# Altium project HV_DAC_1PPM.PrjPcb (part 3 of 3)

## Sheet HV_Stage.SchDoc: HV stage
size A3; Author: M.Beldyga; CompanyName: WUT ISE; DrawnBy: M.Beldyga; Organization: WUT ISE; Address1: PW ISE; Address2: Nowowiejska 15/19 00-665 Warsaw; Address3: micbeldyga@gmail.com; SheetNumber: 7; SheetTotal: 7; ModifiedBy: -; CheckedDate: -; DivGrp: WUT ISE; Designer: M.Beldyga; ModifiedDate: -; ProjectName: Sensor Box
Used 2 times, as channels U_HV_Stage, U_HV_Stage. Parts and nets are listed once, with the designators drawn on the sheet.
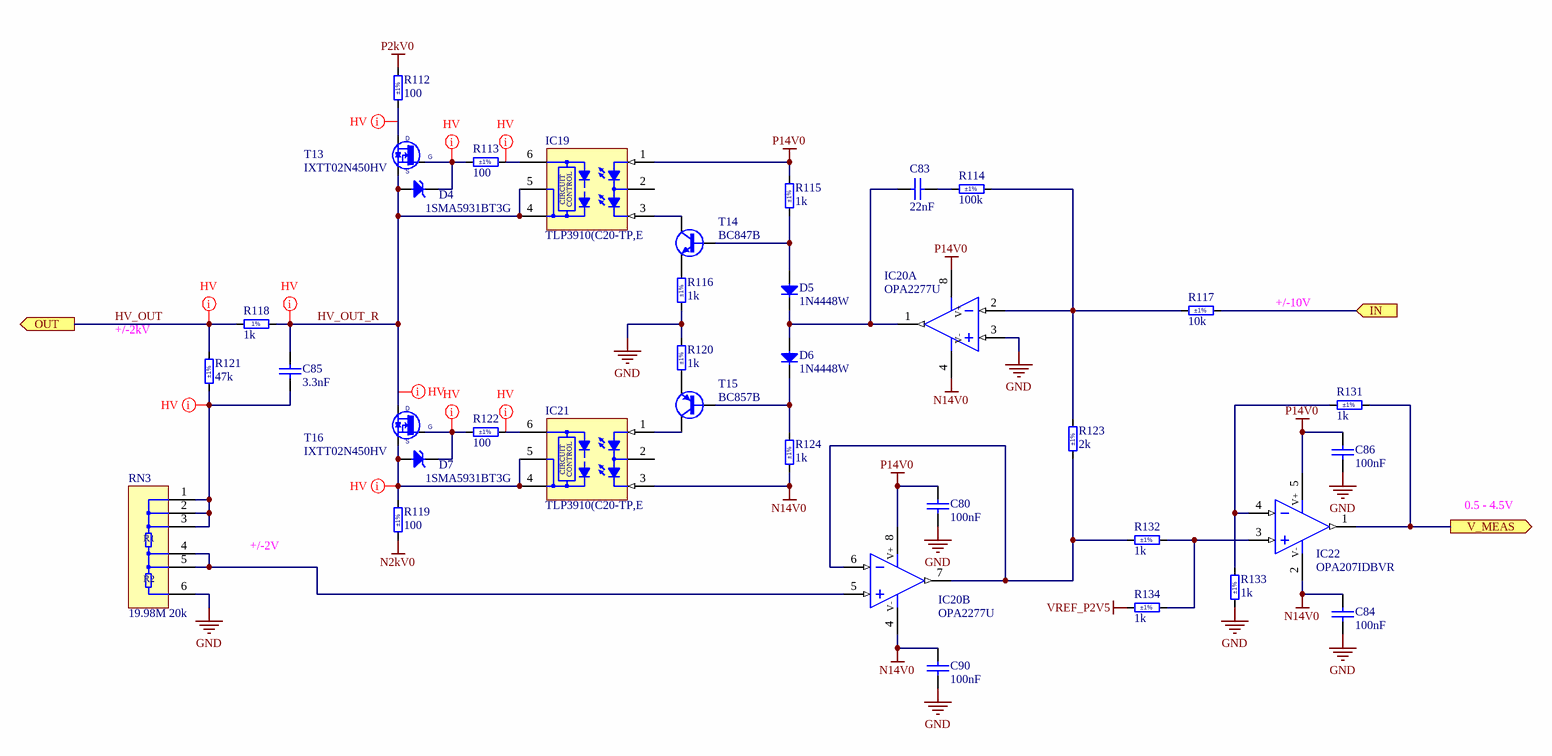
[diagram p6: HV_Stage.SchDoc]

### Parts
C80  100nF  [CAPC1005X55N]
C83  22nF  [CAPC1005X55N]
C84  100nF  [CAPC1005X55N]
C85  3.3nF  [CAPC1608X87N]
C86  100nF  [CAPC1005X55N]
C90  100nF  [CAPC1005X55N]
D4  1SMA5931BT3G  [DIOM5226X220N]
D5  1N4448W  [SOD3715X135N]
D6  1N4448W  [SOD3715X135N]
D7  1SMA5931BT3G  [DIOM5226X220N]
IC19  TLP3910(C20-TP,E  [TOSHIBA_SOIC127P1000X220-6N]
IC20  OPA2277U  [SOIC127P600X175-8N]  (parts A,B of 2)
IC21  TLP3910(C20-TP,E  [TOSHIBA_SOIC127P1000X220-6N]
IC22  OPA207IDBVR  [SOT95P280X145-5N]
R112  100  Tolerance: ±1%  [RESC2012X60N]
R113  100  Tolerance: ±1%  [RESC2012X60N]
R114  100k  Tolerance: ±1%  [RESC1005X40N]
R115  1k  Tolerance: ±1%  [RESC1005X40N]
R116  1k  Tolerance: ±1%  [RESC1005X40N]
R117  10k  Tolerance: ±1%  [RESC1005X40N]
R118  1k  [RESC6331X70N]
R119  100  Tolerance: ±1%  [RESC2012X60N]
R120  1k  Tolerance: ±1%  [RESC1005X40N]
R121  47k  Tolerance: ±1%  [RESC2012X60N]
R122  100  Tolerance: ±1%  [RESC2012X60N]
R123  2k  Tolerance: ±1%  [RESC1005X40N]
R124  1k  Tolerance: ±1%  [RESC1005X40N]
R131  1k  Tolerance: ±1%  [RESC1005X40N]
R132  1k  Tolerance: ±1%  [RESC1005X40N]
R133  1k  Tolerance: ±1%  [RESC1005X40N]
R134  1k  Tolerance: ±1%  [RESC1005X40N]
RN3  19.98M 20k  [RN_CADDOCK_HVD5_vertical]
T13  IXTT02N450HV  [IXYS_TO-268AA (D3Pak-HV)]
T14  BC847B  [SOT95P230X110-3N]
T15  BC857B  [SOT95P230X110-3N]
T16  IXTT02N450HV  [IXYS_TO-268AA (D3Pak-HV)]

### Ports
IN (in), OUT (out), V_MEAS (out)

### Nets
GND: C80.1 C84.1 C86.1 C90.1 IC20.3(IN+) R116.1 R120.2 R133.2 RN3.6
N2kV0: R119.2
N14V0: C84.2 C90.2 IC20.4(V-) IC21.3(K) IC22.2(V-) R124.1
P2kV0: R112.2
P14V0: C80.2 C86.2 IC19.1(A) IC20.8(V+) IC22.5(V+) R115.2
VREF_P2V5: R134.2
HV_OUT: R118.1 R121.2 ; port OUT
HV_OUT_R: C85.2 D4.2(A) IC19.4(K) IC19.5(K) R118.2 T13.2(S) T16.3(D)
IN: R117.2 ; port IN
V_MEAS: IC22.1(OUT) R131.1 ; port V_MEAS
NetC83_1: C83.1 D5.1(C) D6.2(A) IC20.1(OUT)
NetC83_2: C83.2 R114.1
NetC85_1: C85.1 R121.1 RN3.1 RN3.2 RN3.3
NetD4_1: D4.1(C) R113.2 T13.1(G)
NetD5_2: D5.2(A) R115.1 T14.1(B)
NetD6_1: D6.1(C) R124.2 T15.1(B)
NetD7_1: D7.1(C) R122.1 T16.1(G)
NetD7_2: D7.2(A) IC21.4(K) IC21.5(K) R119.1 T16.2(S)
NetIC19_3: IC19.3(K) T14.3(C)
NetIC19_6: IC19.6(A) R113.1
NetIC20_2: IC20.2(IN-) R114.2 R117.1 R123.2
NetIC20_5: IC20.5(IN+) RN3.4 RN3.5
NetIC20_6: IC20.6(IN-) IC20.7(OUT) R123.1 R132.2
NetIC21_1: IC21.1(A) T15.3(C)
NetIC21_6: IC21.6(A) R122.2
NetIC22_3: IC22.3(IN+) R132.1 R134.1
NetIC22_4: IC22.4(IN-) R131.2 R133.1
NetR112_1: R112.1 T13.3(D)
NetR116_2: R116.2 T14.2(E)
NetR120_1: R120.1 T15.2(E)

Not connected (* = marked no-connect by the designer): IC19 2(NC); IC21 2(NC)

### Channels
U_HV_Stage: designators end in B; ports IN=DAC_RFB OUT=HV_OUT V_MEAS=ADC_AIN4
U_HV_Stage: designators end in A; ports IN=DAC_RFB OUT=HV_OUT V_MEAS=ADC_AIN1

### Layout directives
net class HV: HV_OUT, HV_OUT_R_U_HV_Stage, NetC85B_1, NetD4B_1, NetD7B_1, NetD7B_2, NetIC19B_6, NetIC21B_6, NetR112B_1

### Notes on the sheet
- +/-2kV
- +/-10V
- 0.5 - 4.5V
- +/-2V
- Project/Equipment
- Document
- Designer
- Drawn by
- Check.by
- Contact
- File
- Last Mod.
- Print Date
- Sheet
- Size
- A3
- of
- Rev
- (in symbol CRMV2512AF1K00FKEF) 1%
- (in symbol RN_19.98M_20K_CADDOCK_HVD5-A20M-050-05) R1; R2
- (in symbol TLP3910(C20-TP,E) CIRCUIT; CONTROL

### Library data of the parts
C80 C84 C86 C90 = CC0402_100NF_50V_10%_X7R: Non-polarised capacitor; Part Description: SMD Multilayer Chip Ceramic Capacitor; Manufacturer: GENERIC; Manufacturer1 Part Number: GRM155R71H104KE14D; Voltage: 50V; TC: X7R; Tolerance: ±10%; Part Number: CC0402_100NF_50V_10%_X7R; Component Kind: Standard; Component Type: Standard; Pin Count: 2; Value: 100nF; Status: None; Manufacturer Part Number: CC0402_100NF_50V_10%_X7R; Case: 0402; Mounted: Yes; Socket: No; SMD: Yes; Sense: No; Manufacturer1 Example: MURATA; Manufacturer1 ComponentHeight: 0.55mm; HelpURL: \\cern.ch\dfs\Applications\Altium\Datasheets\CC0402_MURATA_GRM155R71H104KE14D.pdf; Author: CERN DEM MR; CreateDate: 6/30/2017; LatestRevisionDate: 6/30/2017
C83 = CC0402_22NF_50V_5%_X7R: Non-polarised capacitor; Part Description: SMD Multilayer Chip Ceramic Capacitor; Manufacturer: GENERIC; Manufacturer1 Part Number: C0402C223J5RAC; Voltage: 50V; TC: X7R; Tolerance: ±5%; Part Number: CC0402_22NF_50V_5%_X7R; Component Kind: Standard; Component Type: Standard; Pin Count: 2; Value: 22nF; Status: Preferred; Manufacturer Part Number: CC0402_22NF_50V_5%_X7R; Case: 0402; Mounted: Yes; Socket: No; SMD: Yes; Sense: No; Manufacturer1 Example: KEMET; Manufacturer1 ComponentHeight: 0.55mm; HelpURL: \\cern.ch\dfs\Applications\Altium\Datasheets\CC0402_X7R_KEMET.pdf; Author: CERN DEM BC; CreateDate: 7/15/2020; LatestRevisionDate: 7/15/2020
C85 = CC0603_3.3NF_100V_1%_C0G: Non-polarised capacitor; Part Description: SMD Multilayer Chip Ceramic Capacitor; Manufacturer: GENERIC; Manufacturer1 Part Number: C0603C332F1GEC; Voltage: 100V; TC: C0G/NP0; Tolerance: ±1%; Part Number: CC0603_3.3NF_100V_1%_C0G; Component Kind: Standard; Component Type: Standard; Pin Count: 2; Value: 3.3nF; Status: None; Manufacturer Part Number: CC0603_3.3NF_100V_1%_C0G; Case: 0603; Mounted: Yes; Socket: No; SMD: Yes; Sense: No; Manufacturer1 Example: KEMET; Manufacturer1 ComponentHeight: 0.87mm; HelpURL: \\cern.ch\dfs\Applications\Altium\Datasheets\CC0603_ESD_C0G_KEMET.pdf; Author: CERN DEM HF; CreateDate: 2/7/2024; LatestRevisionDate: 2/7/2024
D4 D7 = 1SMA5931BT3G: Zener Diode; Part Description: Zener Voltage Regulators; Manufacturer: ON SEMICONDUCTOR; Voltage: 18V; Power: 1.5W; PressFit: No; Bonding: No; Part Number: 1SMA5931BT3G; Component Kind: Standard; Component Type: Standard; Device: 1SMA5931BT3G; PackageDescription: DO-214-AC/SMA Diode, Molded Body; 5.21mm L X 2.60mm W X 2.20mm H, IPC Medium Density; Manufacturer Part Number: 1SMA5931B; Pin Count: 2; Case: DO-214AC; Mounted: Yes; Socket: No; SMD: Yes; Sense: No; ComponentHeight: 2.20mm; HelpURL: \\cern.ch\dfs\Applications\Altium\Datasheets\1SMA5931BT3G.pdf; Author: CERN DEM BC; CreateDate: 4/23/2020; LatestRevisionDate: 5/24/2022
D5 D6 = 1N4448W: Diode; Part Description: Surface Mount Small Signal Fast Switching Diode; Manufacturer: VISHAY SEMICONDUCTORS; Voltage: 75V; Power: 150mA; PressFit: No; Bonding: No; Part Number: 1N4448W; Component Kind: Standard; Component Type: Standard; Device: 1N4448W; PackageDescription: SOD Diode (SOD-123); 2.70mm W X 1.55mm L X 1.35mm H body, IPC Medium Density; Manufacturer Part Number: 1N4448W; Pin Count: 2; Case: SOD-123; Mounted: Yes; Socket: No; SMD: Yes; Sense: No; ComponentHeight: 1.35mm; HelpURL: \\cern.ch\dfs\Applications\Altium\Datasheets\1N4448W.pdf; Author: CERN DEM JLC; CreateDate: 5/15/2017; LatestRevisionDate: 5/15/2017
IC19 IC21 = TLP3910(C20-TP,E: Optoisolator Photovoltaic Output 5000Vrms 2 Channel; Manufacturer: TOSHIBA; PressFit: No; Bonding: No; Part Number: TLP3910(C20-TP,E; Component Kind: Standard; Component Type: Standard; Device: TLP3910(C20-TP,E; PackageDescription: TOSHIBA Case, SOIC, 1.27mm Pitch; 6  Pin, 7.5mm W X 3.84mm; Part Description: Optoisolator Photovoltaic Output 5000Vrms 2 Channel; Manufacturer Part Number: TLP3910(C20-TP,E; Pin Count: 6; Case: SOIC6; Mounted: Yes; Socket: No; SMD: Yes; Sense: No; ComponentHeight: 2.2mm; HelpURL: \\cern.ch\dfs\Applications\Altium\Datasheets\TLP3910.pdf; Author: CERN DEM HF; CreateDate: 6/7/2022; LatestRevisionDate: 6/7/2022
IC20 = OPA2277U: Dual Operational Amplifier; Part Description: Dual High Precision, Operational Amplifier; Manufacturer: TEXAS INSTRUMENTS; PressFit: No; Bonding: No; Part Number: OPA2277U; Component Kind: Standard; Component Type: Standard; Device: OPA2277U; PackageDescription: SOIC 8, Pitch 1.27mm - Body 4x5mm, IPC Medium Density; Manufacturer Part Number: OPA2277U; Pin Count: 8; Case: SOIC8; Mounted: Yes; Socket: No; SMD: Yes; Sense: No; ComponentHeight: 1.75mm; Author: CERN DEM BC; HelpURL: \\cern.ch\dfs\Applications\Altium\Datasheets\OPA2277U.pdf; CreateDate: 8/24/2016; LatestRevisionDate: 8/24/2016
IC22 = OPA207IDBVR: 2.2nV/sqrt Hz, Low-Power, 36-V Operational Amplifier; Manufacturer: TEXAS INSTRUMENTS; Part Number: OPA207IDBVR; Device: OPA207IDBVR; Component Kind: Standard; Component Type: Standard; PackageDescription: SOT, 0.95mm pitch; 5 pin, 1.60mm W X 2.90mm L X 1.45mm H body, IPC Medium Density; Part Description: 2.2nV/sqrt Hz, Low-Power, 36-V Operational Amplifier; Case: SOT 23-5; Manufacturer Part Number: OPA207IDBVR
R112 R113 R119 R122 = R0805_100R_1%_0.125W_100PPM: Resistor - 1%; Part Description: General Purpose Thick Film Chip Resistor; Manufacturer: GENERIC; Manufacturer1 Part Number: NRC10F4700TRF; Power: 0.125W; TC: ±100ppm/°C; PressFit: No; Part Number: R0805_100R_1%_0.125W_100PPM; Component Kind: Standard; Component Type: Standard; Pin Count: 2; Value: 100; Status: Preferred; Manufacturer Part Number: R0805_100R_1%_0.125W_100PPM; Case: 0805; Mounted: Yes; Sense: No; Socket: No; SMD: Yes; Manufacturer1 Example: NIC COMPONENT; Manufacturer1 ComponentHeight: 0.6mm; HelpURL: \\cern.ch\dfs\Applications\Altium\Datasheets\R0805_NIC_NRC.pdf; Author: CERN DEM JLC; CreateDate: 12/3/2007; LatestRevisionDate: 3/13/2008
R114 = R0402_100K_1%_0.0625W_100PPM: Resistor - 1%; Part Description: General Purpose Thick Film Chip Resistor; Manufacturer: GENERIC; Manufacturer1 Part Number: 232270671004L; TC: ±100ppm/°C; PressFit: No; Part Number: R0402_100K_1%_0.0625W_100PPM; Component Kind: Standard; Component Type: Standard; Pin Count: 2; Value: 100k; Status: Not Recommended; Power: 0.0625W; Manufacturer Part Number: R0402_100K_1%_0.0625W_100PPM; Case: 0402; Mounted: Yes; Sense: No; Socket: No; SMD: Yes; Manufacturer1 Example: YAGEO PHYCOMP; Manufacturer1 ComponentHeight: 0.4mm; HelpURL: \\cern.ch\dfs\Applications\Altium\Datasheets\R0402_Phycomp_RC0402.pdf; Author: CERN DEM JLC; CreateDate: 12/3/2007; LatestRevisionDate: 10/17/2012
R115 R116 R120 R124 R131-R134 = R0402_1K_1%_0.0625W_100PPM: Resistor - 1%; Part Description: General Purpose Thick Film Chip Resistor; Manufacturer: GENERIC; Manufacturer1 Part Number: 232270671002L; TC: ±100ppm/°C; PressFit: No; Part Number: R0402_1K_1%_0.0625W_100PPM; Component Kind: Standard; Component Type: Standard; Pin Count: 2; Value: 1k; Status: Not Recommended; Power: 0.0625W; Manufacturer Part Number: R0402_1K_1%_0.0625W_100PPM; Case: 0402; Mounted: Yes; Sense: No; Socket: No; SMD: Yes; Manufacturer1 Example: YAGEO PHYCOMP; Manufacturer1 ComponentHeight: 0.4mm; HelpURL: \\cern.ch\dfs\Applications\Altium\Datasheets\R0402_Phycomp_RC0402.pdf; Author: CERN DEM JLC; CreateDate: 12/3/2007; LatestRevisionDate: 10/17/2012
R117 = R0402_10K_1%_0.0625W_100PPM: Resistor - 1%; Part Description: General Purpose Thick Film Chip Resistor; Manufacturer: GENERIC; Manufacturer1 Part Number: 232270671003L; TC: ±100ppm/°C; PressFit: No; Part Number: R0402_10K_1%_0.0625W_100PPM; Component Kind: Standard; Component Type: Standard; Pin Count: 2; Value: 10k; Status: Not Recommended; Power: 0.0625W; Manufacturer Part Number: R0402_10K_1%_0.0625W_100PPM; Case: 0402; Mounted: Yes; Sense: No; Socket: No; SMD: Yes; Manufacturer1 Example: YAGEO PHYCOMP; Manufacturer1 ComponentHeight: 0.4mm; HelpURL: \\cern.ch\dfs\Applications\Altium\Datasheets\R0402_Phycomp_RC0402.pdf; Author: CERN DEM JLC; CreateDate: 12/3/2007; LatestRevisionDate: 10/17/2012
R118 = CRMV2512AF1K00FKEF: CRMV2512AF 1K 1% 100 Ef E3; Manufacturer: Vishay; Supplier: Mouser; Supplier Part Number: 71-CRMV2512AF1K00FKF; Manufacturer Part Number: CRMV2512AF1K00FKEF; RoHS: No; Category: Chip SMD Resistors; Stock: 4000; Pricing: 1=1.14, 10=0.655, 50=0.655, 100=0.422, 1000=0.305, 10000=0.261 (USD)
R121 = R0805_47K_1%_0.125W_100PPM: Resistor - 1%; Part Description: General Purpose Thick Film Chip Resistor; Manufacturer: GENERIC; Manufacturer1 Part Number: NRC10F4702TRF; Power: 0.125W; TC: ±100ppm/°C; PressFit: No; Part Number: R0805_47K_1%_0.125W_100PPM; Component Kind: Standard; Component Type: Standard; Pin Count: 2; Value: 47k; Status: Preferred; Manufacturer Part Number: R0805_47K_1%_0.125W_100PPM; Case: 0805; Mounted: Yes; Sense: No; Socket: No; SMD: Yes; Manufacturer1 Example: NIC COMPONENT; Manufacturer1 ComponentHeight: 0.6mm; HelpURL: \\cern.ch\dfs\Applications\Altium\Datasheets\R0805_NIC_NRC.pdf; Author: CERN DEM JLC; CreateDate: 12/3/2007; LatestRevisionDate: 3/13/2008
R123 = R0402_2K_1%_0.0625W_100PPM: Resistor - 1%; Part Description: General Purpose Thick Film Chip Resistor; Manufacturer: GENERIC; Manufacturer1 Part Number: 232270672002L; TC: ±100ppm/°C; PressFit: No; Part Number: R0402_2K_1%_0.0625W_100PPM; Component Kind: Standard; Component Type: Standard; Pin Count: 2; Value: 2k; Status: Not Recommended; Power: 0.0625W; Manufacturer Part Number: R0402_2K_1%_0.0625W_100PPM; Case: 0402; Mounted: Yes; Sense: No; Socket: No; SMD: Yes; Manufacturer1 Example: YAGEO PHYCOMP; Manufacturer1 ComponentHeight: 0.4mm; HelpURL: \\cern.ch\dfs\Applications\Altium\Datasheets\R0402_Phycomp_RC0402.pdf; Author: CERN DEM JLC; CreateDate: 12/3/2007; LatestRevisionDate: 10/17/2012
RN3 = RN_19.98M_20K_CADDOCK_HVD5-A20M-050-05: Ultra-Precision Voltage Dividers HVD Series; Power: 31mW; TC: ±5ppm/°C; Tolerance: ±0.1%; Voltage: 2500V; PressFit: No; Part Number: RN_19.98M_20K_CADDOCK_HVD5-A20M-050-05; Component Kind: Standard; Component Type: Standard; Footprint: RN_CADDOCK_HVD5; Pin Count: 5; Value: 19.98M 20k; Status: None; Part Description: Ultra-Precision Voltage Dividers HVD Series; Manufacturer: CADDOCK; Manufacturer Part Number: HVD5-A20M-050-05; Mounted: Yes; Socket: No; SMD: No; Sense: No; ComponentHeight: 15.5mm; HelpURL: \\cern.ch\dfs\Applications\Altium\Datasheets\RN_CADDOCK_HVD.pdf; Author: CERN DEM HF; CreateDate: 27.04.2023; LatestRevisionDate: 27.04.2023
T13 T16 = IXTT02N450HV: MOSFET N-CH 4500V 0.2A TO268; Manufacturer: IXYS; Rds On Max: 750R; Input Capacitance: 256pF; Rise Time: 48ns; Drain to Source Voltage (Vdss): 4.5kV; Continuous Drain Current (ID): 200mA; Max Power Dissipation: 113W; Gate to Source Voltage (Vgs): 20V; Fall Time: 143ns; Turn-Off Delay Time: 28ns; Polarity: N-CHANNEL; Supplier: Mouser; Supplier Part Number: 747-IXTT02N450HV; Manufacturer Part Number: IXTT02N450HV; RoHS: Yes; Category: Transistors; Stock: 803; Pricing: 1=30.1, 10=27.79, 50=20.94, 100=20.94, 1000=20.47, 10000=20.47 (USD); Mounting Technology: Surface Mount; Case/Package: TO-268; Min Operating Temperature: -55°C; Max Operating Temperature: 150°C; Packaging: Rail/Tube; Package Quantity: 30; Drain to Source Resistance: 750R; Drain to Source Breakdown Voltage: 4.5kV; Power Dissipation: 113W; Series: -; RoHS Compliant: Yes; ComponentLink1URL: https://datasheet.ciiva.com/6377/ds100498ixta-t02n450hv-6377632.pdf?src-supplier=Digikey; ComponentLink1Description: https://datasheet.ciiva.com/6377/ds100498ixta-t02n450hv-6377632.pdf?src-supplier=Digikey
T14 = BC847B: NPN Transistor; Part Description: 45V 100mA NPN General-Purpose Transistor; Manufacturer: NXP SEMICONDUCTORS; PressFit: No; Bonding: No; Part Number: BC847B; Component Kind: Standard; Component Type: Standard; Device: BC847B; PackageDescription: SOT23, 0.95mm Pitch; 3 Pin, 1.30mm W X 2.90mm L X 1.10mm H body, IPC Medium Density; Manufacturer Part Number: BC847B; Pin Count: 3; Case: SOT23-3; Mounted: Yes; Socket: No; SMD: Yes; Sense: No; ComponentHeight: 1.1mm; HelpURL: \\cern.ch\dfs\Applications\Altium\Datasheets\BC847B.pdf; Author: CERN DEM JLC; CreateDate: 6/14/2011; LatestRevisionDate: 6/14/2011
T15 = BC857B: PNP Transistor; Part Description: -45V -100mA PNP General-Purpose Transistors; Manufacturer: NXP SEMICONDUCTORS; PressFit: No; Bonding: No; Part Number: BC857B; Component Kind: Standard; Component Type: Standard; Device: BC857B; PackageDescription: SOT23, 0.95mm Pitch; 3 Pin, 1.30mm W X 2.90mm L X 1.10mm H body, IPC Medium Density; Manufacturer Part Number: BC857B; Pin Count: 3; Case: SOT23-3; Mounted: Yes; Socket: No; SMD: Yes; Sense: No; ComponentHeight: 1.1mm; HelpURL: \\cern.ch\dfs\Applications\Altium\Datasheets\BC857B.pdf; Author: CERN DEM JLC; CreateDate: 6/14/2011; LatestRevisionDate: 6/14/2011

## Nets that join several sheets
GND: HV_DAC_1PPM (9 pins), ADC (12 pins), U_DAC (18 pins), Heater (36 pins), Power_Supply (55 pins), Reference (25 pins), U_HV_Stage (9 pins), U_HV_Stage (9 pins), U_DAC (18 pins)
N2kV0: Power_Supply (C14.1 R7.2), U_HV_Stage (R119B.2), U_HV_Stage (R119A.2)
N14V0: U_DAC (11 pins), Power_Supply (C33.2 IC7.5 R30.2), Reference (C60.2 C61.2 IC11.11), U_HV_Stage (6 pins), U_HV_Stage (6 pins), U_DAC (11 pins)
P2kV0: Power_Supply (C5.2 R2.2), U_HV_Stage (R112B.2), U_HV_Stage (R112A.2)
P3V3: HV_DAC_1PPM (C82.2 IC18.8 J5.11), ADC (R94.2 R95.2 R99.1), Power_Supply (R8.2 R13.2 R17.2 T2.2)
P3V3_DAC: U_DAC (10 pins), Power_Supply (T2.3), U_DAC (10 pins)
P5V0A: ADC (R98.2), Heater (9 pins), Power_Supply (C18.2 IC4.5 R10.2)
P12V0: Heater (7 pins), Power_Supply (10 pins), Reference (C54.2 IC13.1 IC13.3)
P12V0_IN: HV_DAC_1PPM (J5.6 J5.8 J5.10), Power_Supply (C6.2 L3.1)
P14V0: U_DAC (11 pins), Power_Supply (5 pins), Reference (C51.1 C52.2 IC11.4), U_HV_Stage (6 pins), U_HV_Stage (6 pins), U_DAC (11 pins)
VREF_P2V5: ADC (C45.2 IC10.5 IC10.16), Reference (C68.2 IC11.6 IC11.7), U_HV_Stage (R134B.2), U_HV_Stage (R134A.2)
VREF_P5V0: Heater (P1.3 R145.2 R146.2), Reference (C65.2 IC11.8 IC11.9)
ADC_AIN0: ADC (IC10.11), Heater (B5.1 R137.1 R139.1)
ADC_AIN1: ADC (IC10.12), U_HV_Stage (IC22A.1 R131A.1)
ADC_AIN4: ADC (IC10.13), U_HV_Stage (IC22B.1 R131B.1)
ADC_AIN5: ADC (IC10.14), Heater (IC8.2 R61.1 R64.2 TP2.1)
ADC_AIN6: ADC (IC10.15), Heater (B6.1 R138.1 R141.1)
ADC_DRDYn: HV_DAC_1PPM (J5.9), ADC (IC10.25)
CSn_ADC: HV_DAC_1PPM (IC18.6), ADC (IC10.24 R94.1)
CSn_DAC1: HV_DAC_1PPM (IC18.5), U_DAC (IC15B.14 R108B.1)
CSn_DAC2: HV_DAC_1PPM (IC18.7), U_DAC (IC15A.14 R108A.1)
DAC_RFB: U_DAC (C71B.2 IC15B.20 IC16B.6), U_HV_Stage (R117B.2)
DAC_RFB: U_HV_Stage (R117A.2), U_DAC (C71A.2 IC15A.20 IC16A.6)
HV_EN: HV_DAC_1PPM (J5.15), Power_Supply (R8.1 T1.1)
HV_OUT: HV_DAC_1PPM (J1.1), U_HV_Stage (R118B.1 R121B.2)
HV_OUT: HV_DAC_1PPM (J3.1), U_HV_Stage (R118A.1 R121A.2)
SPI_CLK: HV_DAC_1PPM (J5.7), ADC (IC10.28), U_DAC (IC15B.13), U_DAC (IC15A.13)
SPI_MISO: HV_DAC_1PPM (J5.3), ADC (IC10.26), U_DAC (IC15B.11), U_DAC (IC15A.11)
SPI_MOSI: HV_DAC_1PPM (J5.1), ADC (IC10.27), U_DAC (IC15B.12), U_DAC (IC15A.12)
VREF_10V0_N: U_DAC (IC14B.3), Reference (C62.2 IC11.14 RN1.5), U_DAC (IC14A.3)
VREF_10V0_P: U_DAC (IC14B.5), Reference (C55.2 IC11.1 RN1.6 RN1.7), U_DAC (IC14A.5)